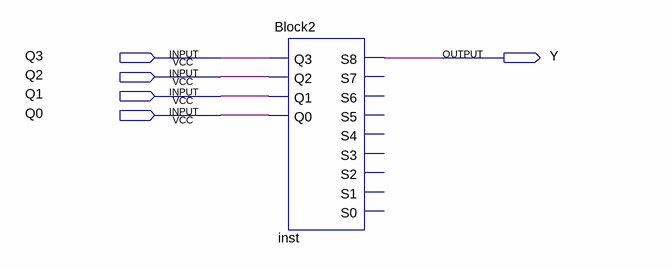
[diagram p0: schematic sheet]
// Quartus schematic block12.bdf as structural Verilog: 1 symbols, 5 pins
module block12 (
  input  Q3,
  input  Q2,
  input  Q1,
  input  Q0,
  output Y
);

  Block2 inst (.Q3(Q3), .Q2(Q2), .Q1(Q1), .Q0(Q0), .S8(Y));  // open: S7, S6, S5, S4, S3, S2, S1, S0
endmodule
